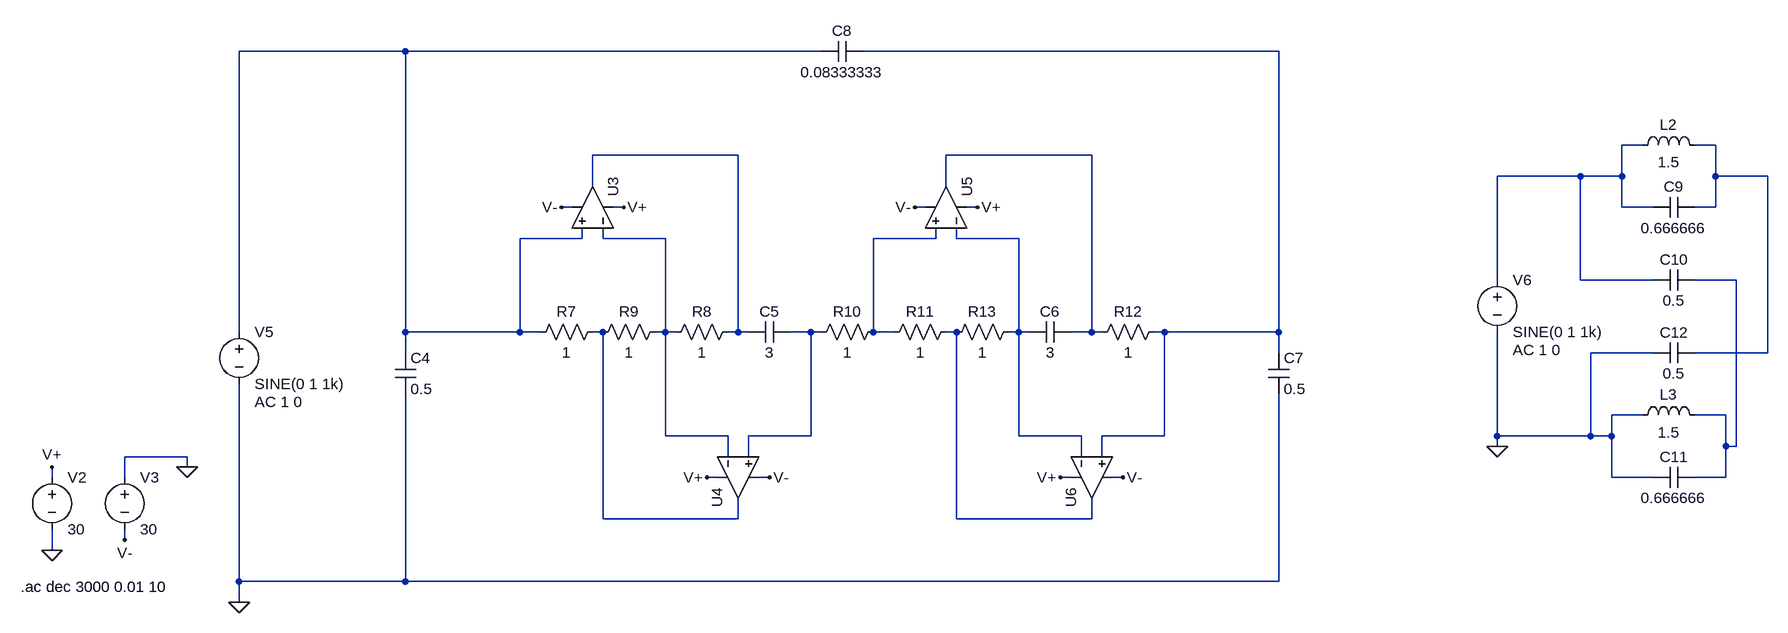
[diagram p0: schematic ej7.asc]
ej7.asc, the LTspice schematic file:
Version 4
SHEET 1 4340 772
WIRE 1840 -192 1584 -192
WIRE 2480 -192 1840 -192
WIRE 3184 -192 2544 -192
WIRE 3744 -48 3712 -48
WIRE 3856 -48 3824 -48
WIRE 2352 -32 2128 -32
WIRE 2896 -32 2672 -32
WIRE 3648 0 3520 0
WIRE 3712 0 3712 -48
WIRE 3712 0 3648 0
WIRE 3856 0 3856 -48
WIRE 3936 0 3856 0
WIRE 2128 16 2128 -32
WIRE 2672 16 2672 -32
WIRE 2096 48 2080 48
WIRE 2176 48 2160 48
WIRE 2640 48 2624 48
WIRE 2720 48 2704 48
WIRE 3712 48 3712 0
WIRE 3760 48 3712 48
WIRE 3856 48 3856 0
WIRE 3856 48 3824 48
WIRE 2112 96 2112 80
WIRE 2112 96 2016 96
WIRE 2144 96 2144 80
WIRE 2240 96 2144 96
WIRE 2656 96 2656 80
WIRE 2656 96 2560 96
WIRE 2688 96 2688 80
WIRE 2784 96 2688 96
WIRE 3520 160 3520 0
WIRE 3648 160 3648 0
WIRE 3760 160 3648 160
WIRE 3888 160 3824 160
WIRE 1584 240 1584 -192
WIRE 1840 240 1840 -192
WIRE 2016 240 2016 96
WIRE 2016 240 1840 240
WIRE 2048 240 2016 240
WIRE 2144 240 2128 240
WIRE 2240 240 2240 96
WIRE 2240 240 2224 240
WIRE 2256 240 2240 240
WIRE 2352 240 2352 -32
WIRE 2352 240 2336 240
WIRE 2368 240 2352 240
WIRE 2464 240 2432 240
WIRE 2480 240 2464 240
WIRE 2560 240 2560 96
WIRE 2592 240 2560 240
WIRE 2688 240 2672 240
WIRE 2784 240 2784 96
WIRE 2784 240 2768 240
WIRE 2800 240 2784 240
WIRE 2896 240 2896 -32
WIRE 2896 240 2864 240
WIRE 2912 240 2896 240
WIRE 3008 240 2992 240
WIRE 3184 240 3184 -192
WIRE 3184 240 3008 240
WIRE 1840 272 1840 240
WIRE 3184 272 3184 240
WIRE 3760 272 3664 272
WIRE 3936 272 3936 0
WIRE 3936 272 3824 272
WIRE 3744 368 3696 368
WIRE 3872 368 3824 368
WIRE 2240 400 2240 240
WIRE 2336 400 2240 400
WIRE 2464 400 2464 240
WIRE 2464 400 2368 400
WIRE 2784 400 2784 240
WIRE 2880 400 2784 400
WIRE 3008 400 3008 240
WIRE 3008 400 2912 400
WIRE 3520 400 3520 240
WIRE 3664 400 3664 272
WIRE 3664 400 3520 400
WIRE 3696 400 3696 368
WIRE 3696 400 3664 400
WIRE 3520 416 3520 400
WIRE 3872 416 3872 368
WIRE 3888 416 3888 160
WIRE 3888 416 3872 416
WIRE 1504 432 1408 432
WIRE 2336 432 2336 400
WIRE 2368 432 2368 400
WIRE 2880 432 2880 400
WIRE 2912 432 2912 400
WIRE 1504 448 1504 432
WIRE 1296 464 1296 448
WIRE 1408 464 1408 432
WIRE 2320 464 2304 464
WIRE 2400 464 2384 464
WIRE 2864 464 2848 464
WIRE 2944 464 2928 464
WIRE 3696 464 3696 400
WIRE 3760 464 3696 464
WIRE 3872 464 3872 416
WIRE 3872 464 3824 464
WIRE 2144 528 2144 240
WIRE 2352 528 2352 496
WIRE 2352 528 2144 528
WIRE 2688 528 2688 240
WIRE 2896 528 2896 496
WIRE 2896 528 2688 528
WIRE 1408 560 1408 544
WIRE 1296 576 1296 544
WIRE 1584 624 1584 320
WIRE 1840 624 1840 336
WIRE 1840 624 1584 624
WIRE 3184 624 3184 336
WIRE 3184 624 1840 624
WIRE 1584 656 1584 624
FLAG 1296 576 0
FLAG 1504 448 0
FLAG 1296 448 V+
FLAG 1408 560 V-
FLAG 2080 48 V-
FLAG 2400 464 V-
FLAG 2176 48 V+
FLAG 2304 464 V+
FLAG 2624 48 V-
FLAG 2944 464 V-
FLAG 2720 48 V+
FLAG 2848 464 V+
FLAG 1584 656 0
FLAG 3520 416 0
SYMBOL voltage 1296 448 R0
WINDOW 123 0 0 Left 0
WINDOW 39 0 0 Left 0
SYMATTR InstName V2
SYMATTR Value 30
SYMBOL voltage 1408 448 R0
WINDOW 123 0 0 Left 0
WINDOW 39 0 0 Left 0
SYMATTR InstName V3
SYMATTR Value 30
SYMBOL voltage 1584 224 R0
WINDOW 123 24 124 Left 2
WINDOW 39 0 0 Left 0
SYMATTR Value2 AC 1 0
SYMATTR InstName V5
SYMATTR Value SINE(0 1 1k)
SYMBOL cap 1824 272 R0
SYMATTR InstName C4
SYMATTR Value 0.5
SYMBOL res 2032 256 R270
WINDOW 0 32 56 VTop 2
WINDOW 3 0 56 VBottom 2
SYMATTR InstName R7
SYMATTR Value 1
SYMBOL cap 2368 256 R270
WINDOW 0 32 32 VTop 2
WINDOW 3 0 32 VBottom 2
SYMATTR InstName C5
SYMATTR Value 3
SYMBOL res 2240 256 R270
WINDOW 0 32 56 VTop 2
WINDOW 3 0 56 VBottom 2
SYMATTR InstName R8
SYMATTR Value 1
SYMBOL res 2128 256 R270
WINDOW 0 32 56 VTop 2
WINDOW 3 0 56 VBottom 2
SYMATTR InstName R9
SYMATTR Value 1
SYMBOL res 2464 256 R270
WINDOW 0 32 56 VTop 2
WINDOW 3 0 56 VBottom 2
SYMATTR InstName R10
SYMATTR Value 1
SYMBOL OpAmps\\UniversalOpAmp 2128 48 M270
SYMATTR InstName U3
SYMATTR Value2 Avol=1000000Meg GBW=10000000Meg Vos=0
SYMATTR SpiceLine En=0 Enk=0 In=0 Ink=0 Rin=500000000Meg
SYMBOL OpAmps\\UniversalOpAmp 2352 464 M90
SYMATTR InstName U4
SYMATTR Value2 Avol=1000000Meg GBW=10000000Meg Vos=0
SYMATTR SpiceLine En=0 Enk=0 In=0 Ink=0 Rin=500000000Meg
SYMBOL res 2576 256 R270
WINDOW 0 32 56 VTop 2
WINDOW 3 0 56 VBottom 2
SYMATTR InstName R11
SYMATTR Value 1
SYMBOL cap 2800 256 R270
WINDOW 0 32 32 VTop 2
WINDOW 3 0 32 VBottom 2
SYMATTR InstName C6
SYMATTR Value 3
SYMBOL res 2896 256 R270
WINDOW 0 32 56 VTop 2
WINDOW 3 0 56 VBottom 2
SYMATTR InstName R12
SYMATTR Value 1
SYMBOL res 2672 256 R270
WINDOW 0 32 56 VTop 2
WINDOW 3 0 56 VBottom 2
SYMATTR InstName R13
SYMATTR Value 1
SYMBOL OpAmps\\UniversalOpAmp 2672 48 M270
SYMATTR InstName U5
SYMATTR Value2 Avol=1000000Meg GBW=10000000Meg Vos=0
SYMATTR SpiceLine En=0 Enk=0 In=0 Ink=0 Rin=500000000Meg
SYMBOL OpAmps\\UniversalOpAmp 2896 464 M90
SYMATTR InstName U6
SYMATTR Value2 Avol=1000000Meg GBW=10000000Meg Vos=0
SYMATTR SpiceLine En=0 Enk=0 In=0 Ink=0 Rin=500000000Meg
SYMBOL cap 3168 272 R0
SYMATTR InstName C7
SYMATTR Value 0.5
SYMBOL cap 2544 -208 R90
WINDOW 0 0 32 VBottom 2
WINDOW 3 32 32 VTop 2
SYMATTR InstName C8
SYMATTR Value 0.08333333
SYMBOL ind 3728 -32 R270
WINDOW 0 32 56 VTop 2
WINDOW 3 5 56 VBottom 2
SYMATTR InstName L2
SYMATTR Value 1.5
SYMBOL cap 3760 64 R270
WINDOW 0 32 32 VTop 2
WINDOW 3 0 32 VBottom 2
SYMATTR InstName C9
SYMATTR Value 0.666666
SYMBOL cap 3760 176 R270
WINDOW 0 32 32 VTop 2
WINDOW 3 0 32 VBottom 2
SYMATTR InstName C10
SYMATTR Value 0.5
SYMBOL ind 3728 384 R270
WINDOW 0 32 56 VTop 2
WINDOW 3 5 56 VBottom 2
SYMATTR InstName L3
SYMATTR Value 1.5
SYMBOL cap 3824 448 R90
WINDOW 0 0 32 VBottom 2
WINDOW 3 32 32 VTop 2
SYMATTR InstName C11
SYMATTR Value 0.666666
SYMBOL cap 3824 256 R90
WINDOW 0 0 32 VBottom 2
WINDOW 3 32 32 VTop 2
SYMATTR InstName C12
SYMATTR Value 0.5
SYMBOL voltage 3520 144 R0
WINDOW 123 24 124 Left 2
WINDOW 39 0 0 Left 0
SYMATTR Value2 AC 1 0
SYMATTR InstName V6
SYMATTR Value SINE(0 1 1k)
TEXT 1248 632 Left 2 !.ac dec 3000 0.01 10

The netlist it stands for:
* ej7.asc
V2 V+ 0 30
V3 0 V- 30
V5 N001 0 SINE(0 1 1k) AC 1 0
C4 N001 0 0.5
R7 N001 N011 1
C5 N005 N012 3
R8 N007 N005 1
R9 N011 N007 1
R10 N012 N008 1
XU3 N001 N007 V+ V- N005 level1 Avol=1000000Meg GBW=10000000Meg Vos=0 En=0 Enk=0 In=0 Ink=0 Rin=500000000Meg  ; pins In+ In- V+ V- OUT
XU4 N012 N007 V+ V- N011 level1 Avol=1000000Meg GBW=10000000Meg Vos=0 En=0 Enk=0 In=0 Ink=0 Rin=500000000Meg  ; pins In+ In- V+ V- OUT
R11 N008 N013 1
C6 N009 N006 3
R12 N006 N002 1
R13 N013 N009 1
XU5 N008 N009 V+ V- N006 level1 Avol=1000000Meg GBW=10000000Meg Vos=0 En=0 Enk=0 In=0 Ink=0 Rin=500000000Meg  ; pins In+ In- V+ V- OUT
XU6 N002 N009 V+ V- N013 level1 Avol=1000000Meg GBW=10000000Meg Vos=0 En=0 Enk=0 In=0 Ink=0 Rin=500000000Meg  ; pins In+ In- V+ V- OUT
C7 N002 0 0.5
C8 N002 N001 0.08333333
L2 N003 N004 1.5
C9 N003 N004 0.666666
C10 N003 N010 0.5
L3 0 N010 1.5
C11 N010 0 0.666666
C12 N004 0 0.5
V6 N003 0 SINE(0 1 1k) AC 1 0
.ac dec 3000 0.01 10
.lib UniversalOpAmp1.lib
.backanno
.end